# EAGLE schematic Reflow Panel Rev F (EAGLE 7.6.0)
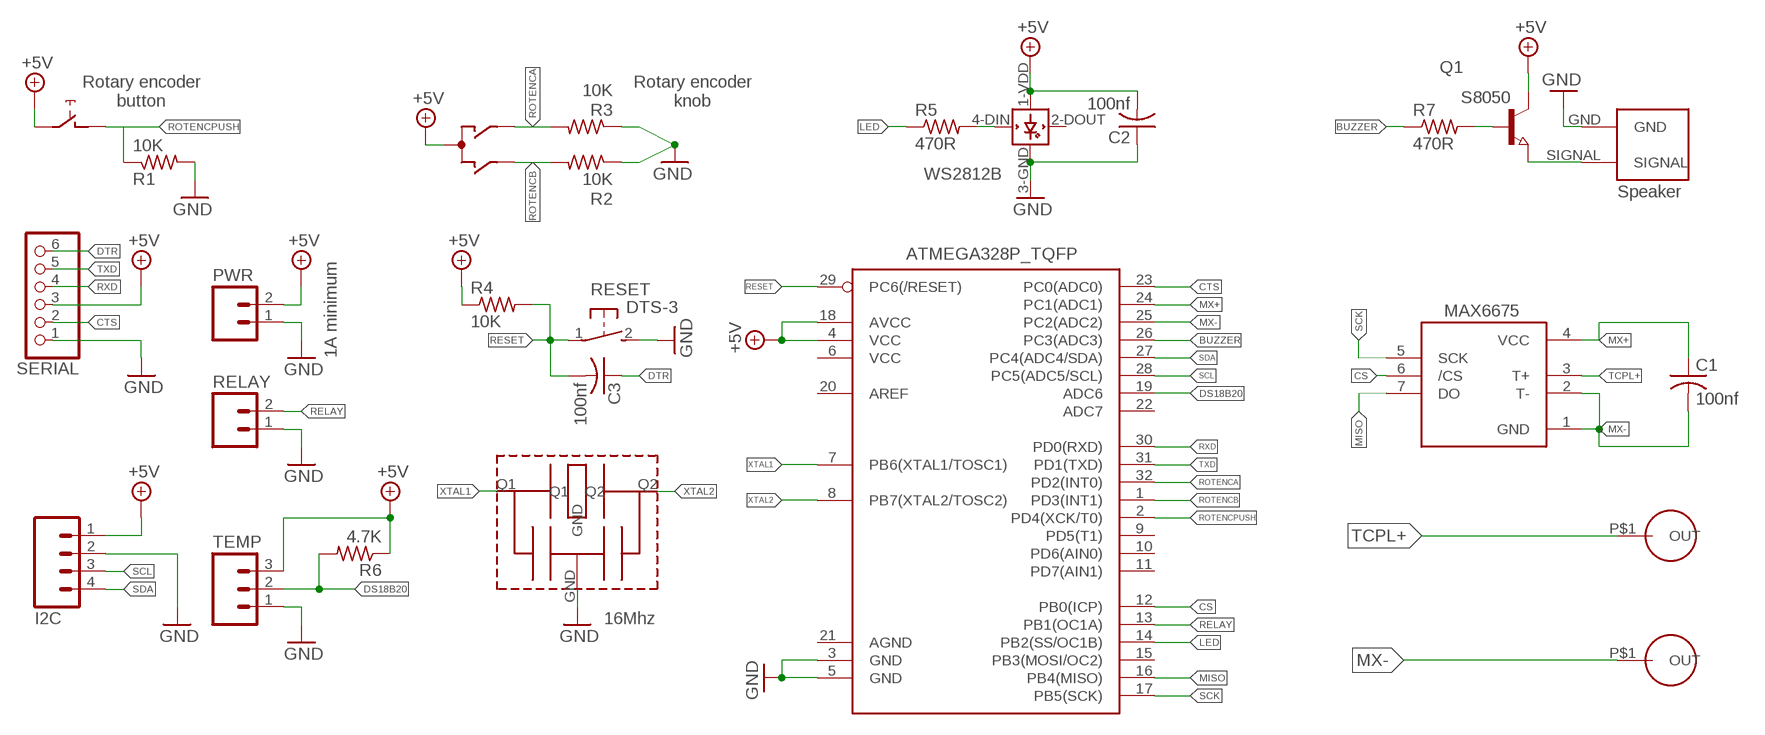
[diagram p0: schematic, sheet 1]

## Parts
C1  100nf  C-USC0805  [C0805]
C2  100nf  C-USC0805  [C0805]
C3  100nf  C-USC0805  [C0805]
I2C  M04LOCK_LONGPADS  [1X04_LOCK_LONGPADS]
IC2  MAX6675  [SO08]
L1  WS2812B_  [WS2812B]
PWR  M02LOCK  [1X02_LOCK]
Q1  NPN-TRANSISTOR_SOT23  [SOT23]
R1  10K  R-US_M0805  [M0805]
R2  10K  R-US_M0805  [M0805]
R3  10K  R-US_M0805  [M0805]
R4  10K  R-US_M0805  [M0805]
R5  470R  R-US_M0805  [M0805]
R6  4.7K  R-US_M0805  [M0805]
R7  470R  R-US_M0805  [M0805]
RELAY  M02LOCK  [1X02_LOCK]
RESET  DTS-3  [DTS-3]
SERIAL  PINHD-1X6LOCK  [1X06-BIGLOCK]
SW1  EC12E_SW  [ALPS_EC12E_SW]
TEMP  M03LOCK  [1X03_LOCK]
U1  ATMEGA328P_TQFP  [TQFP32-08]
U$1  8.5MMSQUAREBUZZER  [8.5MMSQUAREBUZZER]
U$2  CSTCE16M0V53-R0  [CSTCE_V13C]
U$3  BANANAFEMAIL-10.8-5.7  [BANANAFEMALE-10.8-5.7]
U$4  BANANAFEMAIL-10.8-5.7  [BANANAFEMALE-10.8-5.7]

## Nets
+5V: C2.2 I2C.1 L1.1-VDD(VDD) PWR.2 Q1.3(C) R4.1 R6.1 SERIAL.3 SW1.C SW1.E TEMP.3 U1.4(VCC) U1.18(AVCC)
BUZZER: R7.1 U1.26(PC3(ADC3))
CS: IC2.6(/CS) U1.12(PB0(ICP))
CTS: SERIAL.2 U1.23(PC0(ADC0))
DS18B20: R6.2 TEMP.2 U1.19(ADC6)
DTR: C3.1 SERIAL.6
GND: C2.1 I2C.2 L1.3-GND(GND) PWR.1 R1.2 R2.1 R3.1 RELAY.1 RESET.2 SERIAL.1 TEMP.1 U1.3(GND) U1.5(GND) U$1.GND U$2.GND
LED: R5.1 U1.14(PB2(SS/OC1B))
MISO: IC2.7(DO) U1.16(PB4(MISO))
MX+: C1.1 IC2.4(VCC) U1.24(PC1(ADC1))
MX-: C1.2 IC2.1(GND) IC2.2(T-) U1.25(PC2(ADC2)) U$3.P$1(OUT)
N$1: L1.4-DIN(DIN) R5.2
N$2: Q1.2(E) U$1.SIGNAL
N$3: Q1.1(B) R7.2
RELAY: RELAY.2 U1.13(PB1(OC1A))
RESET: C3.2 R4.2 RESET.1 U1.29(PC6(/RESET))
ROTENCA: R3.2 SW1.A U1.32(PD2(INT0))
ROTENCB: R2.2 SW1.B U1.1(PD3(INT1))
ROTENCPUSH: R1.1 SW1.D U1.2(PD4(XCK/T0))
RXD: SERIAL.4 U1.30(PD0(RXD))
SCK: IC2.5(SCK) U1.17(PB5(SCK))
SCL: I2C.3 U1.28(PC5(ADC5/SCL))
SDA: I2C.4 U1.27(PC4(ADC4/SDA))
TCPL+: IC2.3(T+) U$4.P$1(OUT)
TXD: SERIAL.5 U1.31(PD1(TXD))
XTAL1: U1.7(PB6(XTAL1/TOSC1)) U$2.Q1
XTAL2: U1.8(PB7(XTAL2/TOSC2)) U$2.Q2
Unconnected: L1.2-DOUT(DOUT) SW1.GND1(G) SW1.GND2(G) U1.6(VCC) U1.9(PD5(T1)) U1.10(PD6(AIN0)) U1.11(PD7(AIN1)) U1.15(PB3(MOSI/OC2)) U1.20(AREF) U1.21(AGND) U1.22(ADC7)

## Notes on the sheet
- Rotary encoder
  button
- Rotary encoder
  knob
- S8050
- WS2812B
- Speaker
- 1A minimum
- 16Mhz

## Library data of the parts
C1-C3 = rcl:C-US: CAPACITOR, American symbol
I2C = User-Submitted:M04: Header 4 Standard 4-pin 0.1" header. Use with straight break away headers (SKU : PRT-00116), right angle break away headers (PRT-00553), swiss pins (PRT-00743), machine pins (PRT-00117), and female headers (PRT-00115). Molex polarized connector foot print use with SKU : PRT-08231 with associated crimp pins and housings. 1MM SMD Version SKU: PRT-10208
IC2 = adafruit:MAX6675
L1 = adafruit:WS2812B_
PWR RELAY = SparkFun-Connectors:M02: Standard 2-pin 0.1" header. Use with - straight break away headers ( PRT-00116) - right angle break away headers (PRT-00553) - swiss pins (PRT-00743) - machine pins (PRT-00117) - female headers (PRT-00115) Molex polarized connector foot print use with: PRT-08233 with associated crimp pins and housings. 2.54_SCREWTERM for use with PRT-10571. 3.5mm Screw Terminal footprints for PRT-08084 5mm Screw Terminal footprints for use with PRT-08432
Q1 = semicon-smd-ipc:NPN-TRANSISTOR_: NPN TRANSISTOR
R1-R7 = rcl:R-US_: RESISTOR, American symbol
RESET = switch-tact:DTS-3
SERIAL = adafruit:PINHD-1X6: PIN HEADER
SW1 = switch-alps:EC12E_SW: ALPS rotary Encoder EC12E series with switch; MPN: EC12E2424407; OC_FARNELL: 1520813; OC_NEWARK: 74M1068
TEMP = SparkFun-Connectors:M03: Header 3 Standard 3-pin 0.1" header. Use with straight break away headers (SKU : PRT-00116), right angle break away headers (PRT-00553), swiss pins (PRT-00743), machine pins (PRT-00117), and female headers (PRT-00115). Molex polarized connector foot print use with SKU : PRT-08232 with associated crimp pins and housings.
U1 = SparkFun-DigitalIC:ATMEGA328P_TQFP; PROD_ID: IC-09069
U$1 = custom:8.5MMSQUAREBUZZER
U$2 = custom:CSTCE16M0V53-R0
U$3 U$4 = custom:BANANAFEMAIL-10.8-5.7